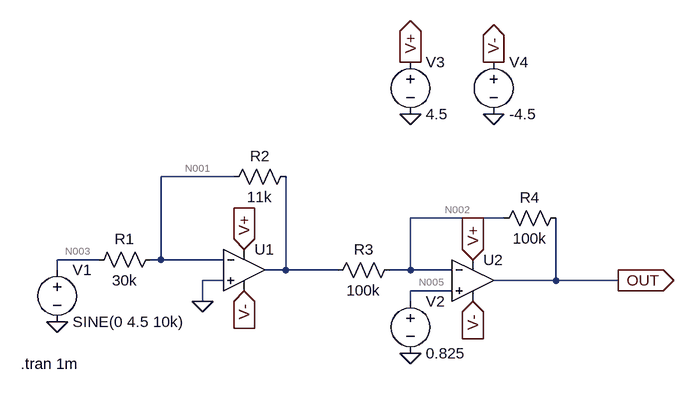
[diagram p0: schematic AnalogFrontend.asc]
AnalogFrontend.asc, the LTspice schematic file:
Version 4
SHEET 1 1356 680
WIRE 464 -96 352 -96
WIRE 880 -32 736 -32
WIRE 256 32 192 32
WIRE 352 32 352 -96
WIRE 352 32 336 32
WIRE 448 32 352 32
WIRE 192 48 192 32
WIRE 544 48 544 -96
WIRE 544 48 512 48
WIRE 624 48 544 48
WIRE 736 48 736 -32
WIRE 736 48 704 48
WIRE 800 48 736 48
WIRE 448 64 416 64
WIRE 960 64 960 -32
WIRE 960 64 864 64
WIRE 1056 64 960 64
WIRE 800 80 736 80
WIRE 416 96 416 64
WIRE 736 96 736 80
FLAG 736 176 0
FLAG 192 128 0
FLAG 480 80 V-
IOPIN 480 80 In
FLAG 832 96 V-
IOPIN 832 96 In
FLAG 736 -272 V+
IOPIN 736 -272 Out
FLAG 480 16 V+
IOPIN 480 16 In
FLAG 832 32 V+
IOPIN 832 32 In
FLAG 416 96 0
FLAG 736 -192 0
FLAG 864 -272 V-
IOPIN 864 -272 Out
FLAG 864 -192 0
FLAG 1056 64 OUT
IOPIN 1056 64 Out
SYMBOL voltage 192 32 R0
WINDOW 123 0 0 Left 0
WINDOW 39 0 0 Left 0
SYMATTR InstName V1
SYMATTR Value SINE(0 4.5 10k)
SYMBOL voltage 736 80 R0
WINDOW 123 0 0 Left 0
WINDOW 39 0 0 Left 0
SYMATTR InstName V2
SYMATTR Value 0.825
SYMBOL res 352 16 R90
WINDOW 0 0 56 VBottom 2
WINDOW 3 32 56 VTop 2
SYMATTR InstName R1
SYMATTR Value 30k
SYMBOL res 560 -112 R90
WINDOW 0 0 56 VBottom 2
WINDOW 3 32 56 VTop 2
SYMATTR InstName R2
SYMATTR Value 11k
SYMBOL res 720 32 R90
WINDOW 0 0 56 VBottom 2
WINDOW 3 32 56 VTop 2
SYMATTR InstName R3
SYMATTR Value 100k
SYMBOL res 976 -48 R90
WINDOW 0 0 56 VBottom 2
WINDOW 3 32 56 VTop 2
SYMATTR InstName R4
SYMATTR Value 100k
SYMBOL OpAmps\\UniversalOpAmp 480 48 R0
SYMATTR InstName U1
SYMBOL OpAmps\\UniversalOpAmp 832 64 R0
SYMATTR InstName U2
SYMBOL voltage 736 -288 R0
WINDOW 123 0 0 Left 0
WINDOW 39 0 0 Left 0
SYMATTR InstName V3
SYMATTR Value 4.5
SYMBOL voltage 864 -288 R0
WINDOW 123 0 0 Left 0
WINDOW 39 0 0 Left 0
SYMATTR InstName V4
SYMATTR Value -4.5
TEXT 136 192 Left 2 !.tran 1m

The netlist it stands for:
* AnalogFrontend.asc
V1 N003 0 SINE(0 4.5 10k)
V2 N005 0 0.825
R1 N001 N003 30k
R2 N004 N001 11k
R3 N002 N004 100k
R4 OUT N002 100k
XU1 0 N001 V+ V- N004 level1 Avol=1Meg GBW=10Meg Vos=0 En=0 Enk=0 In=0 Ink=0 Rin=500Meg  ; pins In+ In- V+ V- OUT
XU2 N005 N002 V+ V- OUT level1 Avol=1Meg GBW=10Meg Vos=0 En=0 Enk=0 In=0 Ink=0 Rin=500Meg  ; pins In+ In- V+ V- OUT
V3 V+ 0 4.5
V4 V- 0 -4.5
.tran 1m
.lib UniversalOpAmp1.lib
.backanno
.end

* Results of the author's LTspice run, read from the files saved beside the schematic
* Operating Point, zero values left out:
*   V(n005) = 825 mV
*   V(n002) = 825 mV
*   V(out) = 1.65 V
*   V(v+) = 4.5 V
*   V(v-) = -4.5 V
*   I(R3) = 8.25 µA
*   I(R4) = 8.252 µA
*   I(V2) = -1.65 nA
*   I(V3) = -16.35 nA
*   I(V4) = 19.65 nA
*   Ix(u1:3) = 9 nA
*   Ix(u1:4) = -9 nA
*   Ix(u1:5) = 8.25 µA
*   Ix(u2:1) = 1.65 nA
*   Ix(u2:2) = 1.65 nA
*   Ix(u2:3) = 7.35 nA
*   Ix(u2:4) = -10.65 nA
*   Ix(u2:5) = -8.251 µA
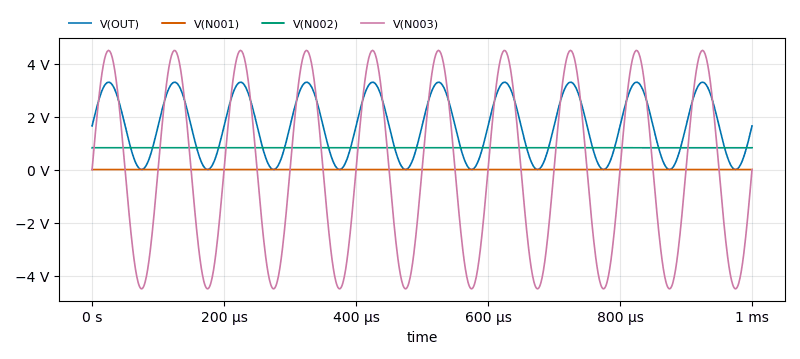
[diagram p1: Transient Analysis of AnalogFrontend.asc, plotted from the saved traces]
* Transient Analysis, 1 run:
*   V(OUT): min 1.734 mV, max 3.299 V, average 1.65 V, rms 2.02 V, last 1.645 V
*   V(N001): min -1.649 mV, max 1.65 mV, average -32.24 nV, rms 1.166 mV, last 1.65 mV
*   V(N002): min 823.3 mV, max 826.6 mV, average 825 mV, rms 825 mV, last 823.3 mV
*   V(N003): min -4.5 V, max 4.5 V, average -1.306 mV, rms 3.182 V, last 0 V